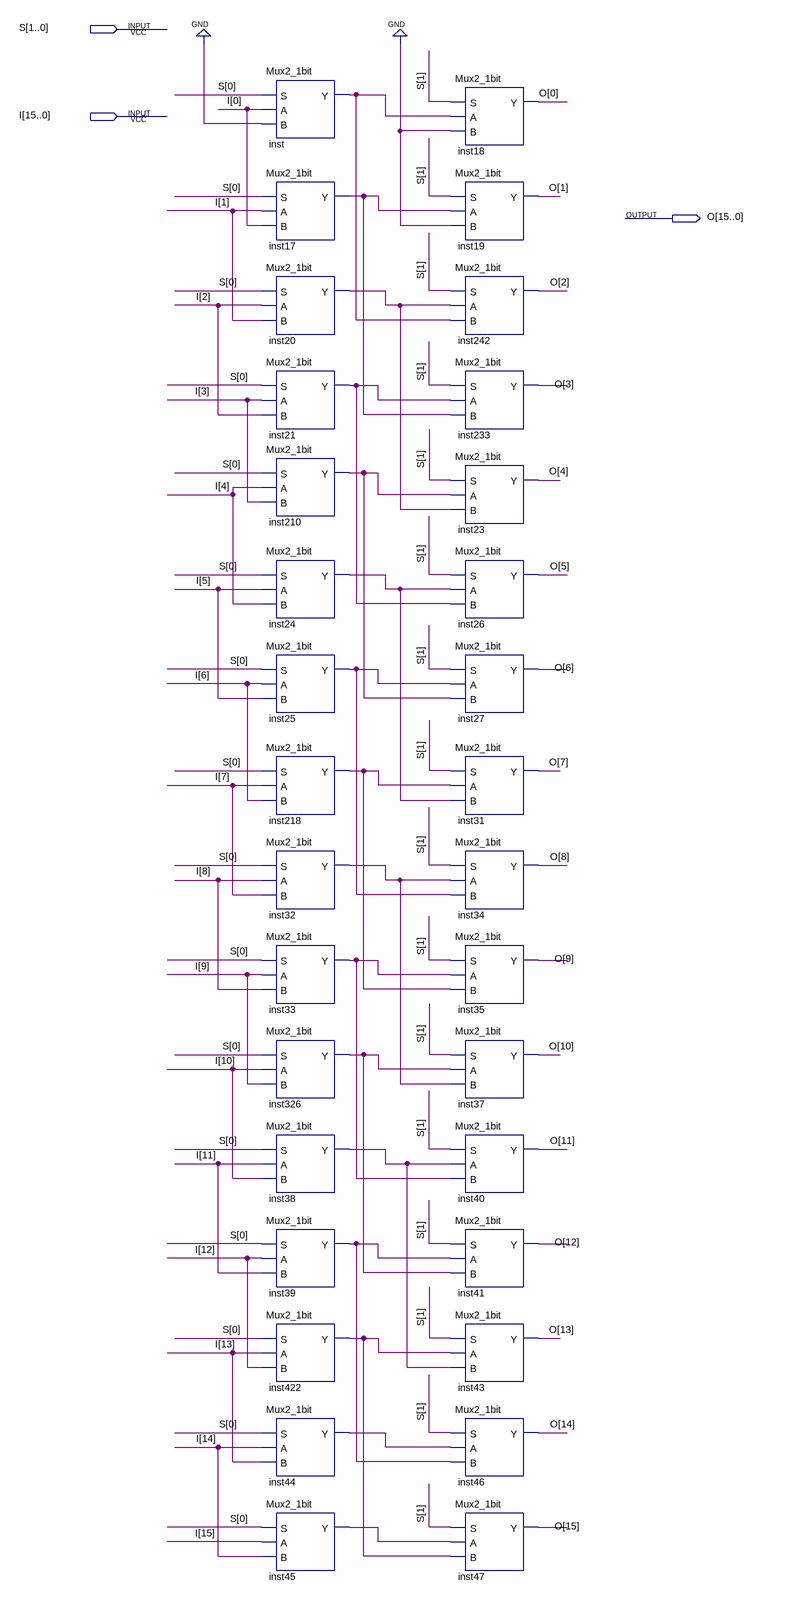
[diagram p0: schematic sheet]
// Quartus schematic ShiftLeft16.bdf as structural Verilog: 32 symbols, 3 pins
module ShiftLeft16 (
  input  [1:0] S,
  input  [15:0] I,
  output [15:0] O
);

  wire inst17_y, inst20_y, inst21_y, inst24_y, inst25_y, inst32_y, inst33_y, inst38_y, inst39_y, inst44_y,
       inst45_y, inst210_y, inst218_y, inst326_y, inst422_y, inst_y;

  Mux2_1bit inst (.S(S[0]), .A(I[0]), .B(1'b0), .Y(inst_y));
  Mux2_1bit inst17 (.S(S[0]), .A(I[1]), .B(I[0]), .Y(inst17_y));
  Mux2_1bit inst20 (.S(S[0]), .A(I[2]), .B(I[1]), .Y(inst20_y));
  Mux2_1bit inst21 (.S(S[0]), .A(I[3]), .B(I[2]), .Y(inst21_y));
  Mux2_1bit inst210 (.S(S[0]), .A(I[4]), .B(I[3]), .Y(inst210_y));
  Mux2_1bit inst24 (.S(S[0]), .A(I[5]), .B(I[4]), .Y(inst24_y));
  Mux2_1bit inst25 (.S(S[0]), .A(I[6]), .B(I[5]), .Y(inst25_y));
  Mux2_1bit inst218 (.S(S[0]), .A(I[7]), .B(I[6]), .Y(inst218_y));
  Mux2_1bit inst32 (.S(S[0]), .A(I[8]), .B(I[7]), .Y(inst32_y));
  Mux2_1bit inst33 (.S(S[0]), .A(I[9]), .B(I[8]), .Y(inst33_y));
  Mux2_1bit inst326 (.S(S[0]), .A(I[10]), .B(I[9]), .Y(inst326_y));
  Mux2_1bit inst38 (.S(S[0]), .A(I[11]), .B(I[10]), .Y(inst38_y));
  Mux2_1bit inst39 (.S(S[0]), .A(I[12]), .B(I[11]), .Y(inst39_y));
  Mux2_1bit inst422 (.S(S[0]), .A(I[13]), .B(I[12]), .Y(inst422_y));
  Mux2_1bit inst44 (.S(S[0]), .A(I[14]), .B(I[13]), .Y(inst44_y));
  Mux2_1bit inst45 (.S(S[0]), .A(I[15]), .B(I[14]), .Y(inst45_y));
  Mux2_1bit inst18 (.S(S[1]), .A(inst_y), .B(1'b0), .Y(O[0]));
  Mux2_1bit inst19 (.S(S[1]), .A(inst17_y), .B(1'b0), .Y(O[1]));
  Mux2_1bit inst242 (.S(S[1]), .A(inst20_y), .B(inst_y), .Y(O[2]));
  Mux2_1bit inst233 (.S(S[1]), .A(inst21_y), .B(inst17_y), .Y(O[3]));
  Mux2_1bit inst23 (.S(S[1]), .A(inst210_y), .B(inst20_y), .Y(O[4]));
  Mux2_1bit inst26 (.S(S[1]), .A(inst24_y), .B(inst21_y), .Y(O[5]));
  Mux2_1bit inst27 (.S(S[1]), .A(inst25_y), .B(inst210_y), .Y(O[6]));
  Mux2_1bit inst31 (.S(S[1]), .A(inst218_y), .B(inst24_y), .Y(O[7]));
  Mux2_1bit inst34 (.S(S[1]), .A(inst32_y), .B(inst25_y), .Y(O[8]));
  Mux2_1bit inst35 (.S(S[1]), .A(inst33_y), .B(inst218_y), .Y(O[9]));
  Mux2_1bit inst37 (.S(S[1]), .A(inst326_y), .B(inst32_y), .Y(O[10]));
  Mux2_1bit inst40 (.S(S[1]), .A(inst38_y), .B(inst33_y), .Y(O[11]));
  Mux2_1bit inst41 (.S(S[1]), .A(inst39_y), .B(inst326_y), .Y(O[12]));
  Mux2_1bit inst43 (.S(S[1]), .A(inst422_y), .B(inst38_y), .Y(O[13]));
  Mux2_1bit inst46 (.S(S[1]), .A(inst44_y), .B(inst39_y), .Y(O[14]));
  Mux2_1bit inst47 (.S(S[1]), .A(inst45_y), .B(inst422_y), .Y(O[15]));
endmodule
